# Altium project Front Power Distribution.PrjPcb
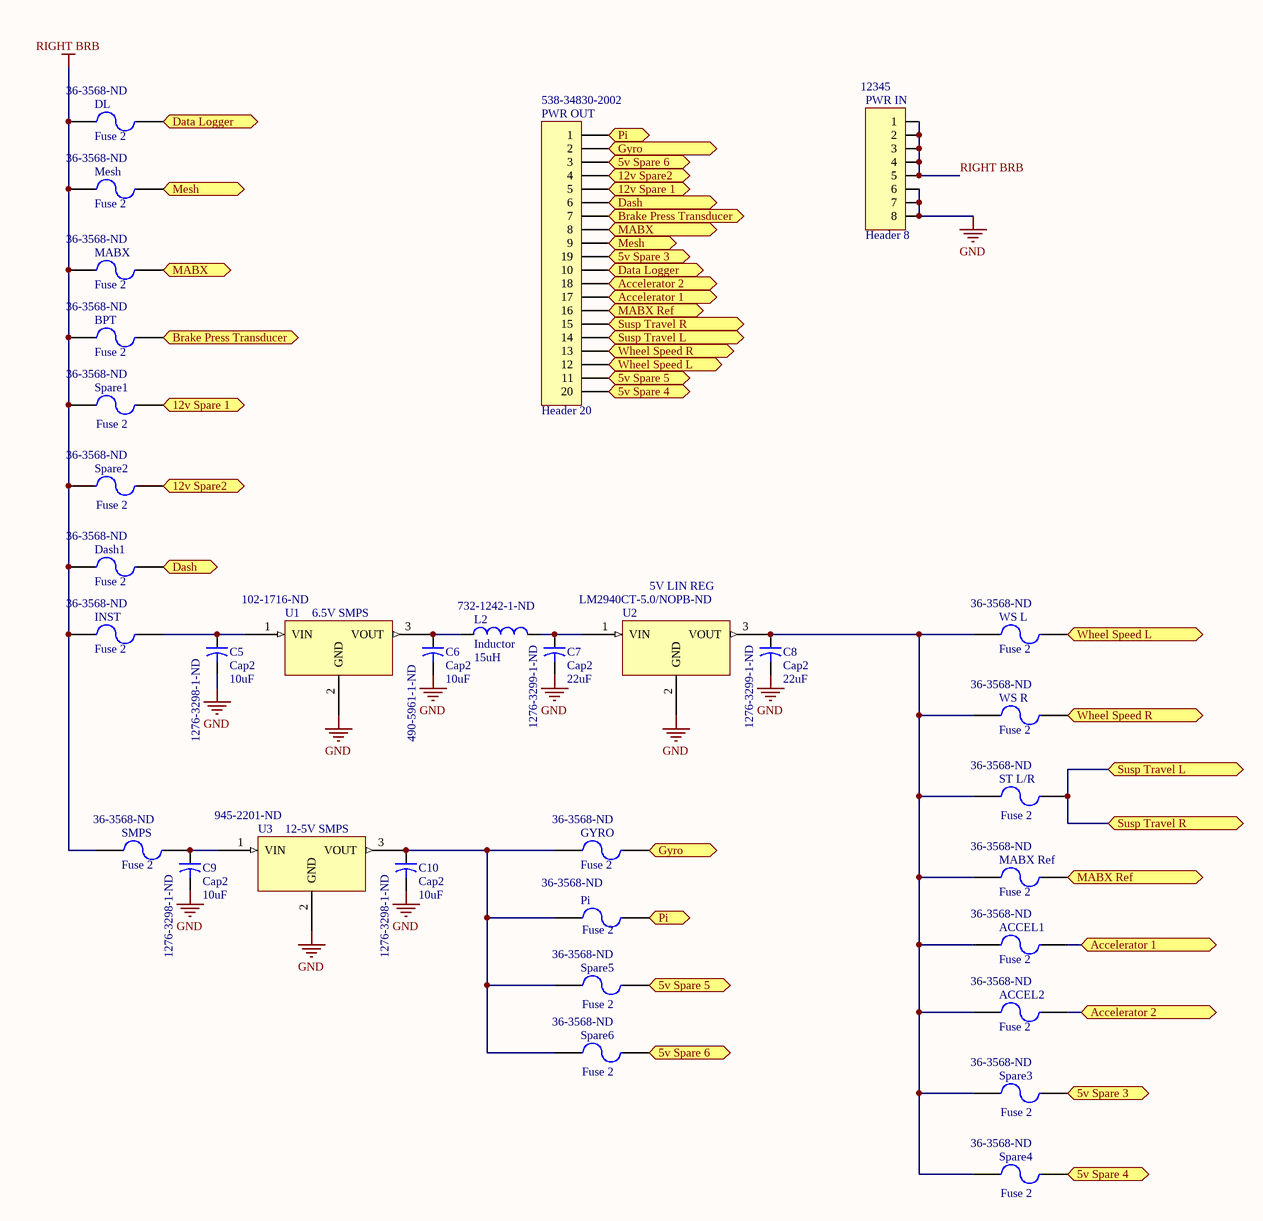
[diagram p0: Front Power Dist.SchDoc]
1 sheet, 33 parts. Net scope: flat (ports and power ports of the same name join across sheets).
Board files: Front Power Dist.PcbDoc, PCB1.PcbDoc

## Sheet Front Power Dist.SchDoc
size Tabloid

### Parts
ACCEL1  Fuse 2  Supplier Part Number 2: 36-3568-ND  [Fuse Holder Mini ATC/ATO]
ACCEL2  Fuse 2  Supplier Part Number 2: 36-3568-ND  [Fuse Holder Mini ATC/ATO]
BPT  Fuse 2  Supplier Part Number 2: 36-3568-ND  [Fuse Holder Mini ATC/ATO]
C5  Cap2  value 10uF  Supplier Part Number 1: 1276-3298-1-ND  [1206]
C6  Cap2  value 10uF  Supplier Part Number 1: 490-5961-1-ND  [1206]
C7  Cap2  value 22uF  Supplier Part Number 1: 1276-3299-1-ND  [1206]
C8  Cap2  value 22uF  Supplier Part Number 1: 1276-3299-1-ND  [1206]
C9  Cap2  value 10uF  Supplier Part Number 1: 1276-3298-1-ND  [1206]
C10  Cap2  value 10uF  Supplier Part Number 1: 1276-3298-1-ND  [1206]
Dash1  Fuse 2  Supplier Part Number 2: 36-3568-ND  [Fuse Holder Mini ATC/ATO]
DL  Fuse 2  Supplier Part Number 2: 36-3568-ND  [Fuse Holder Mini ATC/ATO]
GYRO  Fuse 2  Supplier Part Number 2: 36-3568-ND  [Fuse Holder Mini ATC/ATO]
INST  Fuse 2  Supplier Part Number 2: 36-3568-ND  [Fuse Holder Mini ATC/ATO]
L2  Inductor  value 15uH  Supplier Part Number 1: 732-1242-1-ND  [FILTER INDUCTOR]
MABX  Fuse 2  Supplier Part Number 2: 36-3568-ND  [Fuse Holder Mini ATC/ATO]
MABX_Ref  Fuse 2  Supplier Part Number 2: 36-3568-ND  [Fuse Holder Mini ATC/ATO]
Mesh  Fuse 2  Supplier Part Number 2: 36-3568-ND  [FUSE HOLDER MINI ATC/ATO]
Pi  Fuse 2  Supplier Part Number 2: 36-3568-ND  [Fuse Holder Mini ATC/ATO]
PWR_IN  Header 8  Supplier Part Number: 12345  [MX150 8 PIN]
PWR_OUT  Header 20  Supplier Part Number 1: 538-34830-2002  [MX150 20 PIN]
SMPS  Fuse 2  Supplier Part Number 2: 36-3568-ND  [Fuse Holder Mini ATC/ATO]
Spare1  Fuse 2  Supplier Part Number 2: 36-3568-ND  [Fuse Holder Mini ATC/ATO]
Spare2  Fuse 2  Supplier Part Number 2: 36-3568-ND  [Fuse Holder Mini ATC/ATO]
Spare3  Fuse 2  Supplier Part Number 2: 36-3568-ND  [Fuse Holder Mini ATC/ATO]
Spare4  Fuse 2  Supplier Part Number 2: 36-3568-ND  [Fuse Holder Mini ATC/ATO]
Spare5  Fuse 2  Supplier Part Number 2: 36-3568-ND  [Fuse Holder Mini ATC/ATO]
Spare6  Fuse 2  Supplier Part Number 2: 36-3568-ND  [Fuse Holder Mini ATC/ATO]
ST_L/R  Fuse 2  Supplier Part Number 2: 36-3568-ND  [Fuse Holder Mini ATC/ATO]
U1  6.5V SMPS  Supplier Part Number 1: 102-1716-ND  [V7806-1000]
U2  5V LIN REG  Supplier Part Number 1: LM2940CT-5.0/NOPB-ND  [TO-220-3]
U3  12-5V SMPS  Supplier Part Number 1: 945-2201-ND  [Rr-788E5]
WS_L  Fuse 2  Supplier Part Number 2: 36-3568-ND  [Fuse Holder Mini ATC/ATO]
WS_R  Fuse 2  Supplier Part Number 2: 36-3568-ND  [Fuse Holder Mini ATC/ATO]

### Ports
5v Spare 3, 5v Spare 4, 5v Spare 5, 5v Spare 6, 12v Spare2, 12v Spare 1, Accelerator 1, Accelerator 2, Brake Press Transducer, Dash, Data Logger, Gyro, MABX, MABX Ref, Mesh, Pi, Susp Travel L, Susp Travel R, Wheel Speed L, Wheel Speed R

### Nets
GND: C5.2 C6.2 C7.2 C8.2 C9.2 C10.2 PWR_IN.6 PWR_IN.7 PWR_IN.8 U1.2(GND) U2.2(GND) U3.2(GND)
RIGHT BRB: BPT.2 Dash1.2 DL.2 INST.2 MABX.2 Mesh.1 PWR_IN.1 PWR_IN.2 PWR_IN.3 PWR_IN.4 PWR_IN.5 SMPS.2 Spare1.2 Spare2.2
NetACCEL1_1: ACCEL1.1 PWR_OUT.17 ; port Accelerator 1
NetACCEL1_2: ACCEL1.2 ACCEL2.2 C8.1 MABX_Ref.2 Spare3.2 Spare4.2 ST_L/R.2 U2.3(VOUT) WS_L.2 WS_R.2
NetACCEL2_1: ACCEL2.1 PWR_OUT.18 ; port Accelerator 2
NetBPT_1: BPT.1 PWR_OUT.7 ; port Brake Press Transducer
NetC5_1: C5.1 INST.1 U1.1(VIN)
NetC6_1: C6.1 L2.1 U1.3(VOUT)
NetC7_1: C7.1 L2.2 U2.1(VIN)
NetC9_1: C9.1 SMPS.1 U3.1(VIN)
NetC10_1: C10.1 GYRO.2 Pi.2 Spare5.2 Spare6.2 U3.3(VOUT)
NetDash1_1: Dash1.1 PWR_OUT.6 ; port Dash
NetDL_1: DL.1 PWR_OUT.10 ; port Data Logger
NetGYRO_1: GYRO.1 PWR_OUT.2 ; port Gyro
NetMABX_1: MABX.1 PWR_OUT.8 ; port MABX
NetMABX_Ref_1: MABX_Ref.1 PWR_OUT.16 ; port MABX Ref
NetMesh_2: Mesh.2 PWR_OUT.9 ; port Mesh
NetPi_1: Pi.1 PWR_OUT.1 ; port Pi
NetPWR_OUT_3: PWR_OUT.3 Spare6.1 ; port 5v Spare 6
NetPWR_OUT_4: PWR_OUT.4 Spare2.1 ; port 12v Spare2
NetPWR_OUT_5: PWR_OUT.5 Spare1.1 ; port 12v Spare 1
NetPWR_OUT_11: PWR_OUT.11 Spare5.1 ; port 5v Spare 5
NetPWR_OUT_12: PWR_OUT.12 WS_L.1 ; port Wheel Speed L
NetPWR_OUT_13: PWR_OUT.13 WS_R.1 ; port Wheel Speed R
NetPWR_OUT_14: PWR_OUT.14 PWR_OUT.15 ST_L/R.1 ; port Susp Travel L, port Susp Travel R
NetPWR_OUT_19: PWR_OUT.19 Spare3.1 ; port 5v Spare 3
NetPWR_OUT_20: PWR_OUT.20 Spare4.1 ; port 5v Spare 4

### Library data of the parts
ACCEL1 ACCEL2 BPT Dash1 DL GYRO INST MABX MABX_Ref Mesh Pi SMPS Spare1-Spare6 ST_L/R WS_L WS_R = Fuse 2: Fuse; Published: 8-Jun-2000; LatestRevisionDate: 17-Jul-2002; LatestRevisionNote: Re-released for DXP Platform.; PackageReference: PIN-W2/E2.8; Publisher: Altium Limited; PackageDescription: Thru-Hole; 2 Leads; Supplier 1: Digi-Key; Supplier 2: Digi-Key
C5-C10 = Cap2: Capacitor; Published: 23-Sep-2002; PackageReference: CAPR5-4X5; Publisher: Altium Limited; PackageDescription: Capacitor; 2 Leads; Supplier 1: Digi-Key
L2 = Inductor: Code_IEC: 1005; Published: 8-Jun-2000; LatestRevisionDate: 29-May-2009; LatestRevisionNote: IPC-7351 Footprint Added.; PackageReference: 0402-A; Publisher: Altium Limited; PackageDescription: Chip Inductor; Code_JEITA: 0402; Supplier 1: Digi-Key
PWR_IN = 8 Pin Connector
PWR_OUT = Header 20: Header, 20-Pin; LatestRevisionDate: 17-Jul-2002; LatestRevisionNote: Re-released for DXP Platform.; Publisher: Altium Limited; Supplier 1: Mouser
U1-U3 = Component_1: Supplier 1: Digi-Key